# EAGLE design RCS_Battery_Pack_v2 (EAGLE 8.7.1)
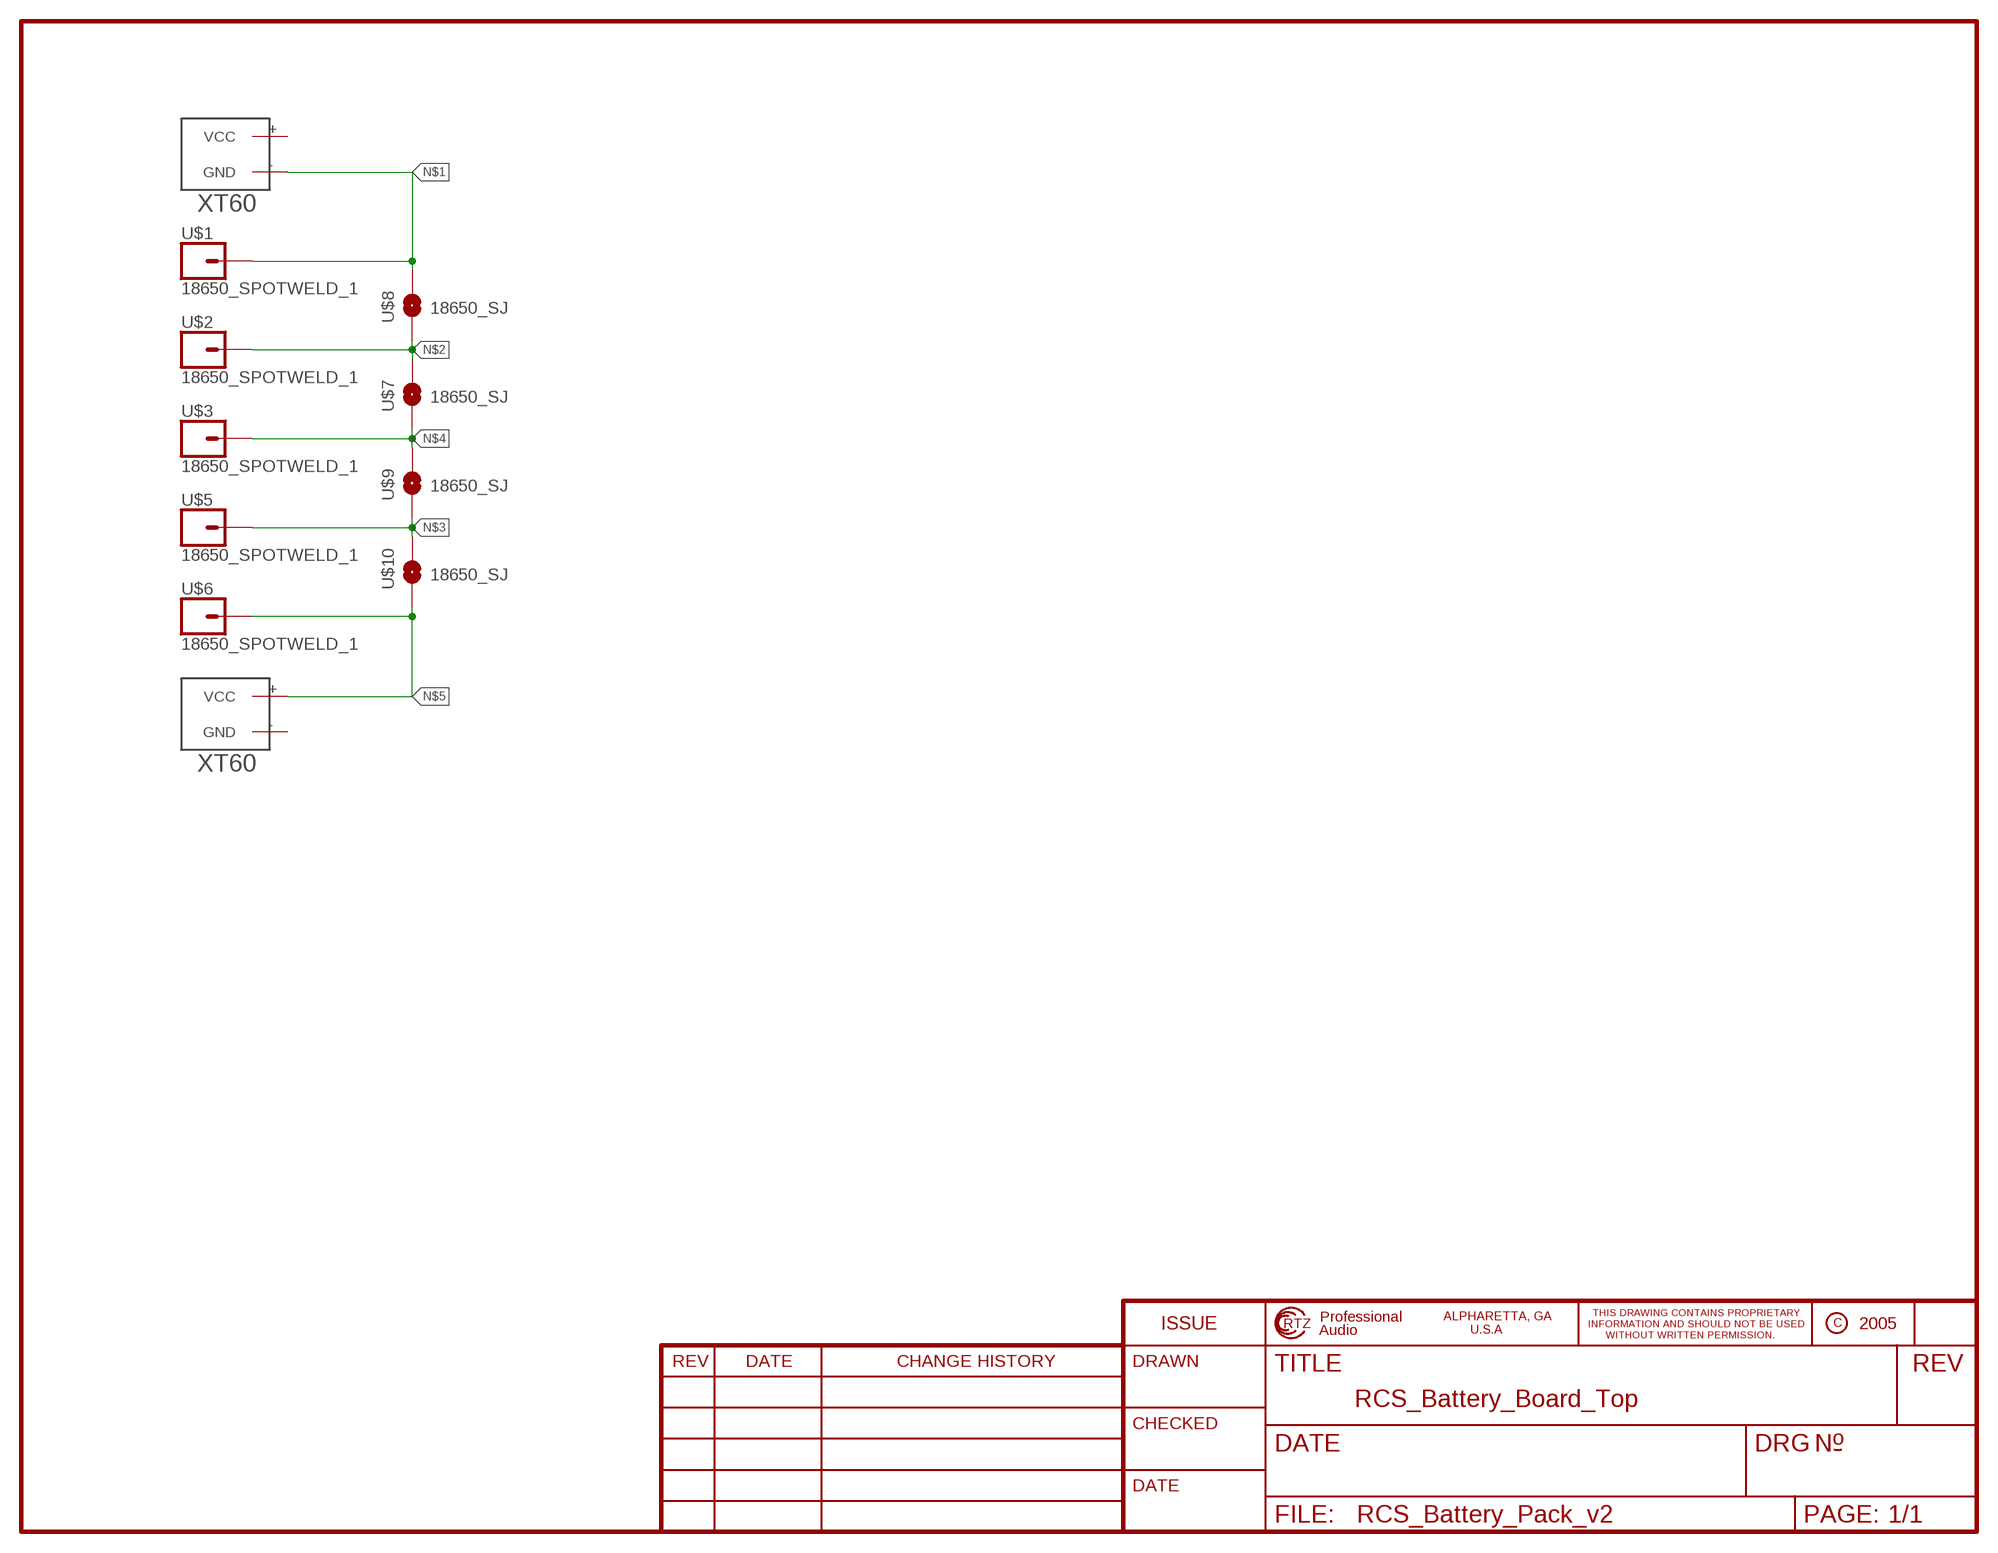
[diagram p0: schematic, sheet 1]

## Parts
U$1  18650_SPOTWELD_1  [18650_SPOTWELD_1]
U$2  18650_SPOTWELD_1  [18650_SPOTWELD_1]
U$3  18650_SPOTWELD_1  [18650_SPOTWELD_1]
U$4  XT60  [XT60]
U$5  18650_SPOTWELD_1  [18650_SPOTWELD_1]
U$6  18650_SPOTWELD_1  [18650_SPOTWELD_1]
U$7  18650_SJ  [SJ_2S-NO]
U$8  18650_SJ  [SJ_2S-NO]
U$9  18650_SJ  [SJ_2S-NO]
U$10  18650_SJ  [SJ_2S-NO]
U$11  XT60  [XT60]

## Nets
N$1: U$1.1 U$4.-(GND) U$8.2
N$2: U$2.1 U$7.2 U$8.1
N$3: U$5.1 U$9.1 U$10.2
N$4: U$3.1 U$7.1 U$9.2
N$5: U$6.1 U$10.1 U$11.+(VCC)
Unconnected: U$4.+(VCC) U$11.-(GND)

## Notes on the sheet
- RCS_Battery_Board_Top

## Library data of the parts
U$1-U$3 U$5 U$6 = Shawn'sCustomComponents:18650_SPOTWELD_1
U$4 U$11 = XT60:XT60: XT60
U$7-U$10 = Shawn'sCustomComponents:18650_SJ

## Net classes
1 N$1: width 0.813 mm

## Board
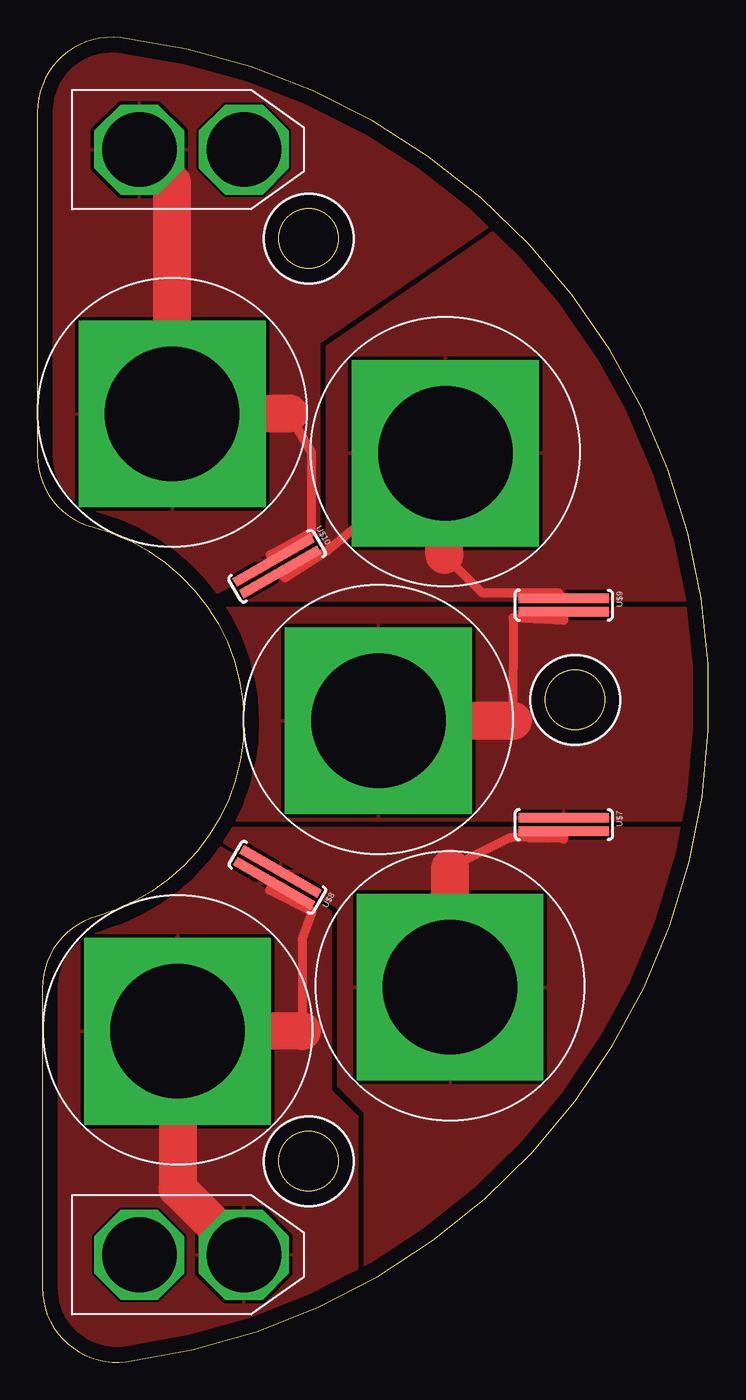
[diagram p1: board, top side]

Size 44.92 x 88.71 mm. Coordinates in mm from the lower left corner, seen from the top.
Outline: 3.98,29.85 arc74 0.33,25.03 0.33,5 arc97 5.96,0.04 arc166 5.59,88.67 arc97 0,83.71 0,60.74 arc75 3.74,55.91 arc-150 3.98,29.85
Outline: circle at 35.99,44.34 radius 2
Outline: circle at 18.16,75.23 radius 2
Outline: circle at 18.16,13.46 radius 2
Copper layers (1*16): Top 0.035mm / dielectric 1.5mm / Bottom 0.035mm
Design rules "default": minimum track width 6mil, minimum drill 0.35mm, track to track 6mil, track to pad 6mil, pad to pad 6mil, via to via 6mil, smd to smd 6mil, copper to edge 40mil, drill to drill 6mil, minimum pad ring 10mil, minimum via ring 8mil, stop-mask expansion 4mil, vias tented up to drill 0mil, thermal gap 10mil

### Footprints (pad centres in the part's own frame; a part is rotated, then mirrored left to right if it is on the bottom)
18650_SPOTWELD_1 = drill 9 pad 12.5 square: 1 0,-0.1
XT60 = drill 5 octagon: + 4.5,0; - 11.5,0
SJ_2S-NO = smd 0.635 x 6: 1 -0.45,0; 2 0.45,0

### Placement (x,y rotation side)
U$1  9.39,22.25 0 top
U$2  27.62,25.2 0 top
U$3  22.83,43.04 0 top
U$4  2.33,7.19 0 top
U$5  27.31,60.96 0 top
U$6  9.03,63.59 0 top
U$7  35.23,35.99 270 top
U$8  16.06,32.46 240 top
U$9  35.23,50.69 270 top
U$10  16.04,53.3 300 top
U$11  2.33,81.19 0 top

### Tracks (layer width: path | path; a pad name or v marks a point on that pad's centre or on a via)
N$1
  Top 0.61: U$8.2 15.54,31.61 18.39,30.19 17.73,28.34 17.73,22.17
  Top 2.54: 17.73,22.17 U$1.1 9.39,11.63 U$4.-
  pour Top: 19.63,30.17 10.49,35.5 -0.43,30.42 -0.43,0.19 21.41,0.19 21.41,16.45 19.63,18.23
N$2
  Top 0.61: U$7.2 35.23,35.02 31.67,35.12 27.61,33.09
  Top 2.54: 27.61,33.09 U$2.1
  pour Top: 21.92,4 21.92,16.7 20.14,18.48 20.14,30.42 11.25,35.5 11.25,35.75 45.79,35.75 45.79,4.51
N$3
  Top 0.61: U$9.1 34.87,51.5 29.79,51.5 27.25,54.04 | U$5.1 27.25,60.8 19.38,54.3 16.58,52.52 U$10.2
  Top 2.54: 27.25,54.04 27.25,60.8
  pour Top: 12.52,50.99 45.54,50.99 45.54,69.28 36.4,79.7 19.38,68.01 19.38,55.06
N$4
  Top 0.61: U$9.2 35.23,49.67 31.85,49.83 31.82,42.94
  Top 2.54: 31.82,42.94 U$3.1
  pour Top: 10.74,36.26 45.79,36.26 45.79,50.49 10.74,50.49
N$5
  Top 0.61: U$10.1 15.57,54.04 18.36,55.57 18.36,60.9 16.84,63.52
  Top 2.54: 16.84,63.52 U$6.1 9.03,78.99 U$11.+
  pour Top: 31.82,77.16 18.87,68.27 18.87,55.31 10.82,50.82 -0.87,50.87 -0.94,89.09 15.82,89.09